# Altium schematic sheet TopLevel.SchDoc: Powerboard Overview
size A4; Author: Robocup; Organization: Hamburg Bit-Bots; Address1: Vogt-Kölln-Str. 30; Address2: 225257 Hamburg; Address3: Germany; Address4: www.bit-bots.de; DocumentNumber: 1; Revision: A; SheetNumber: 1; SheetTotal: 7; EMail: info@bit-bots.de
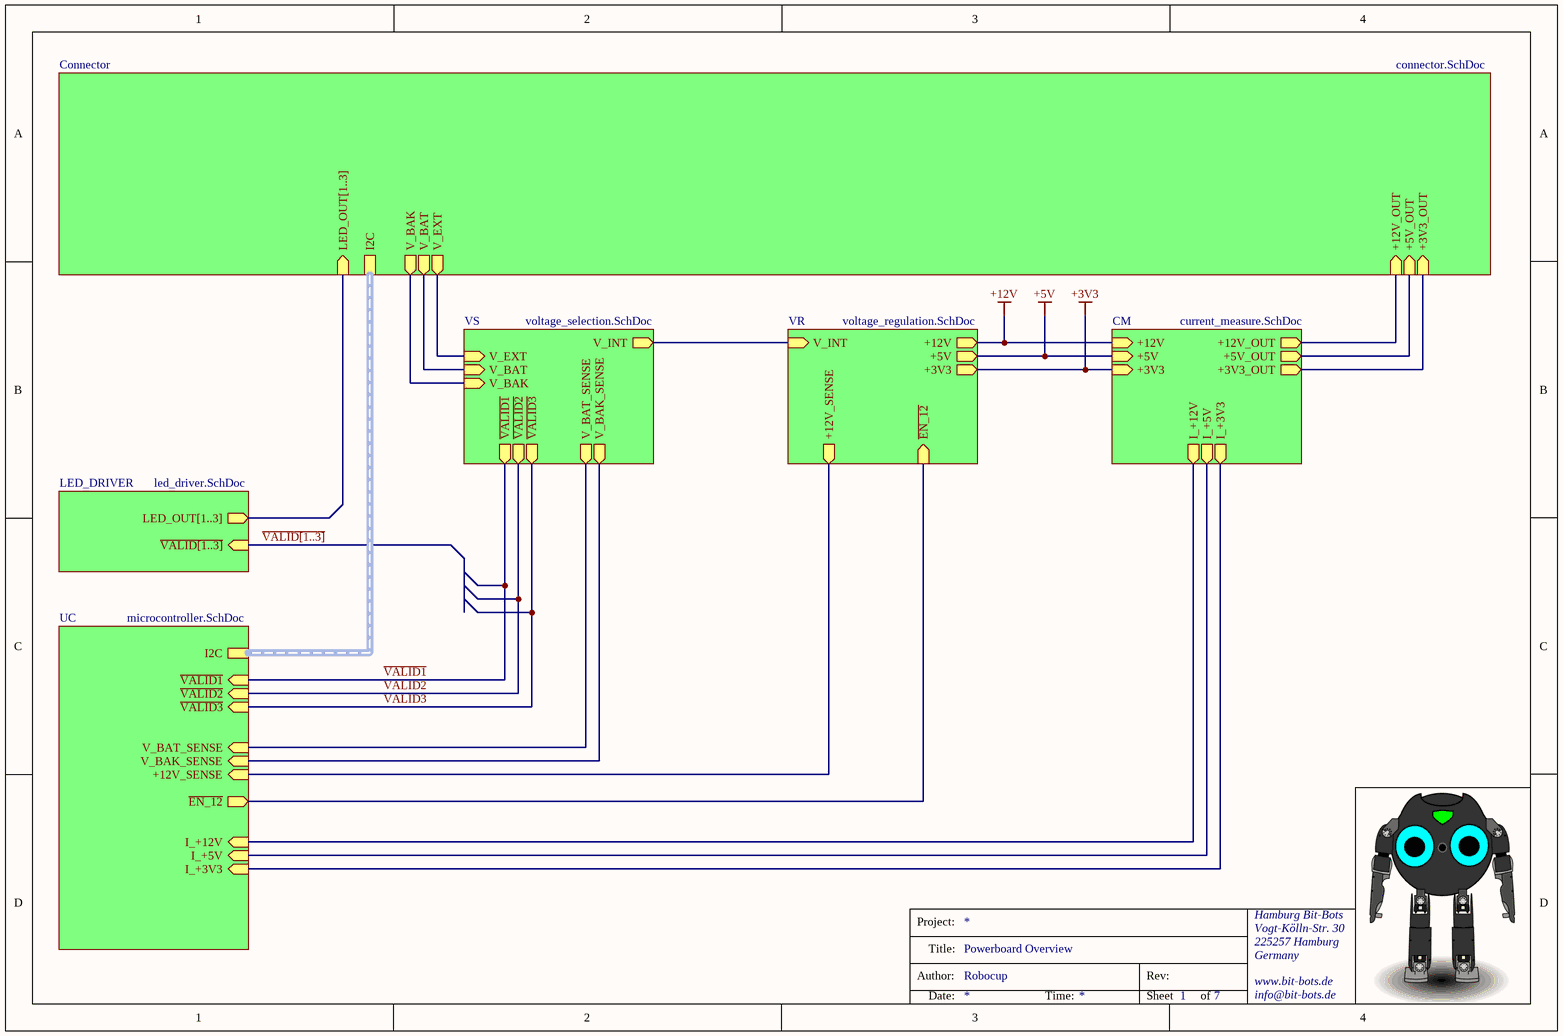
[diagram p0: TopLevel.SchDoc]

## Sub-sheets
CM = current_measure.SchDoc: +12V (in), +3V3 (in), +3V3_OUT (out), +5V_OUT (out), +12V_OUT (out), +5V (in), I_+12V (out), I_+5V (out), I_+3V3 (out)
Connector = connector.SchDoc: +12V_OUT (in), +5V_OUT (in), +3V3_OUT (in), I2C (harness I2C), V_EXT (out), V_BAT (out), V_BAK (out), LED_OUT[1..3] (in)
LED_DRIVER = led_driver.SchDoc: ~{VALID[1..3]} (in), LED_OUT[1..3] (out)
UC = microcontroller.SchDoc: I2C (harness I2C), I_+12V (in), I_+5V (in), I_+3V3 (in), ~{VALID1} (in), ~{VALID2} (in), ~{VALID3} (in), ~{EN_12} (out), +12V_SENSE (in), V_BAK_SENSE (in), V_BAT_SENSE (in)
VR = voltage_regulation.SchDoc: V_INT (in), ~{EN_12} (in), +12V (out), +5V (out), +3V3 (out), +12V_SENSE (out)
VS = voltage_selection.SchDoc: V_EXT (in), V_BAT (in), V_BAK (in), V_INT (out), ~{VALID1} (out), ~{VALID2} (out), ~{VALID3} (out), V_BAT_SENSE (out), V_BAK_SENSE (out)

## Nets
+3V3: sheet CM/+3V3, sheet VR/+3V3
+5V: sheet CM/+5V, sheet VR/+5V
+12V: sheet CM/+12V, sheet VR/+12V
~{VALID1}: sheet VS/~{VALID1}, sheet UC/~{VALID1}
~{VALID2}: sheet VS/~{VALID2}, sheet UC/~{VALID2}
~{VALID3}: sheet VS/~{VALID3}, sheet UC/~{VALID3}
(unnamed): sheet Connector/+12V_OUT, sheet CM/+12V_OUT
(unnamed): sheet Connector/+5V_OUT, sheet CM/+5V_OUT
(unnamed): sheet Connector/+3V3_OUT, sheet CM/+3V3_OUT
(unnamed): sheet Connector/V_EXT, sheet VS/V_EXT
(unnamed): sheet Connector/V_BAT, sheet VS/V_BAT
(unnamed): sheet Connector/V_BAK, sheet VS/V_BAK
(unnamed): sheet CM/I_+12V, sheet UC/I_+12V
(unnamed): sheet CM/I_+5V, sheet UC/I_+5V
(unnamed): sheet CM/I_+3V3, sheet UC/I_+3V3
(unnamed): sheet VR/V_INT, sheet VS/V_INT
(unnamed): sheet VR/~{EN_12}, sheet UC/~{EN_12}
(unnamed): sheet VR/+12V_SENSE, sheet UC/+12V_SENSE
(unnamed): sheet VS/V_BAT_SENSE, sheet UC/V_BAT_SENSE
(unnamed): sheet VS/V_BAK_SENSE, sheet UC/V_BAK_SENSE

## Buses and harness runs
bus sheet Connector/LED_OUT[1..3] = sheet LED_DRIVER/LED_OUT[1..3]
bus ~{VALID[1..3]} = sheet LED_DRIVER/~{VALID[1..3]}
harness sheet Connector/I2C = sheet UC/I2C

## Notes on the sheet
- Project:
- Author:
- Title:
- Rev:
- Date:
- Time:
- Sheet
- of